# Altium schematic sheet 3_P3.schdoc
size 307 x 218 mm; Symbol: Drawing-Symbol_A4; Device: Drawing-Symbol_A4; Company: 嘉立创EDA; Version: V1.0; Page Size: A4; @Project Name: TUSB4020BPHP; @Page Count: 2; @Update Date: 2025-04-17; @Create Date: 2025-04-13; @Schematic Name: Schematic1; @Page No: 2; @Page Name: P2; @Create Time: 01:15:57; @Update Time: 21:07:25; Width: 1170; Height: 825; Region Start: 1; X Region Count: 6; Y Region Count: 4; Blade Width: 10; Title Block Position: 3; @Board Name: Board1; SheetNumber: 2; SheetTotal: 2
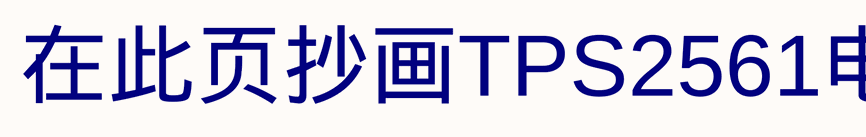
[diagram p0: 3_P3.schdoc]

## Notes on the sheet
- 在此页抄画TPS2561电路原理图
- 1
- 2
- 3
- 4
- 5
- 6
- A
- B
- C
- 原理图
- Schematic1
- 创建日期
- 更新日期
- 2025-04-13
- 2025-04-17
- 板子
- 绘制
- Board1
- 图页
- P2
- D
- 审阅
- 版本
- 尺寸
- TUSB4020BPHP
- 页    2    共    2
- V1.0
- A4
- 嘉立创EDA